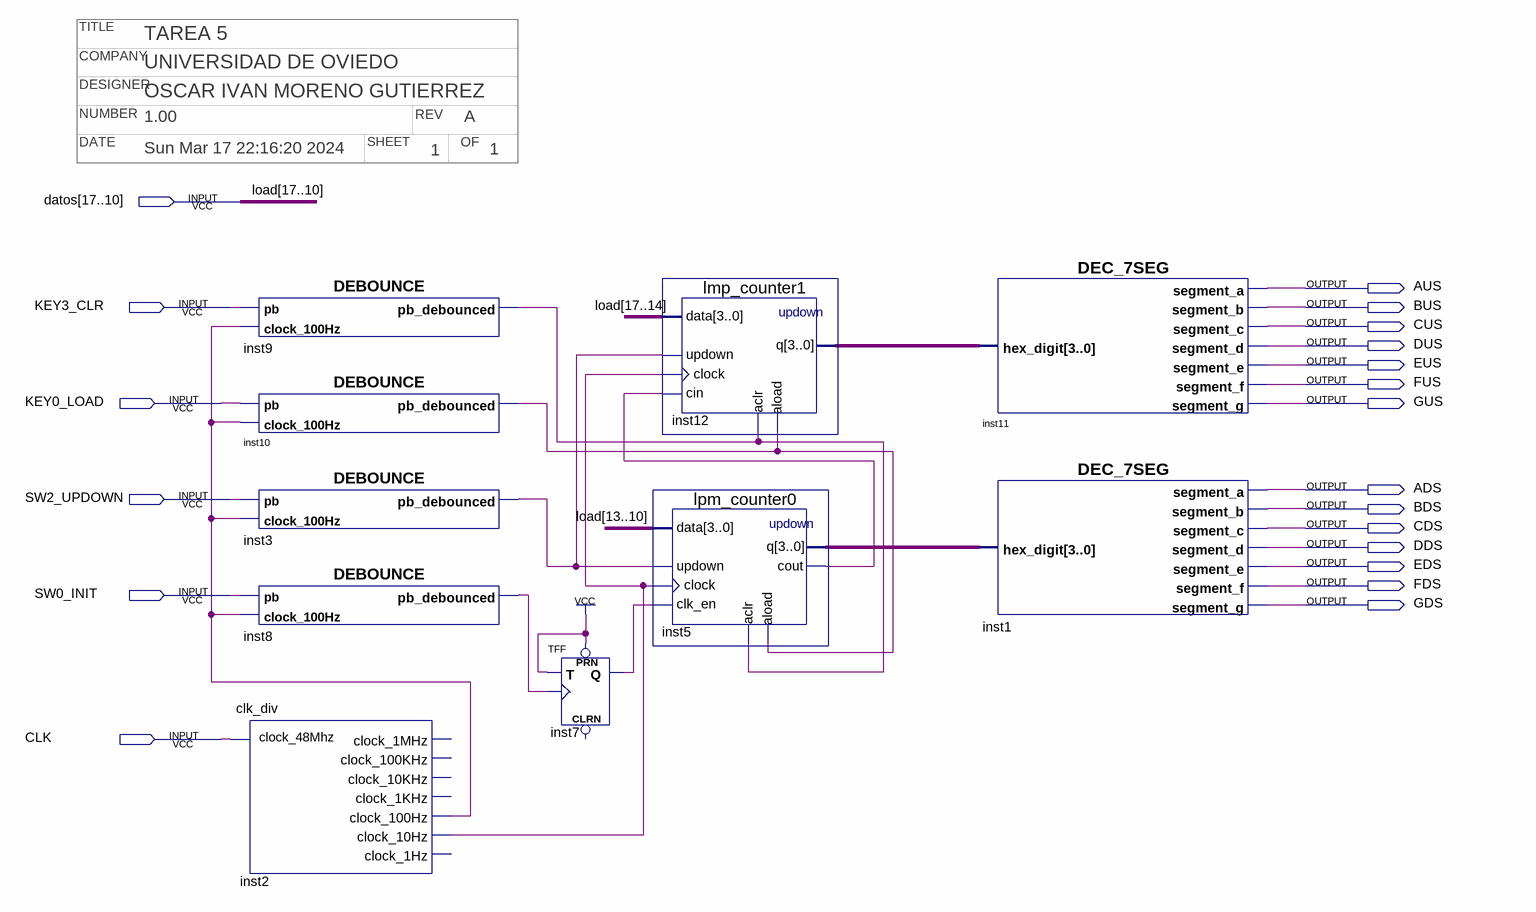
[diagram p0: schematic sheet]
// Quartus schematic tutor3.bdf as structural Verilog: 10 symbols, 20 pins
// Title block: COMPANY: UNIVERSIDAD DE OVIEDO; DATE: Sun Mar 17 22:16:20 2024; DESIGNER: OSCAR IVAN MORENO GUTIERREZ; NUMBER: 1.00; OF: 1; REV: A; SHEET: 1; TITLE: TAREA 5
module tutor3 (
  input  [17:10] datos,
  input  KEY3_CLR,
  input  KEY0_LOAD,
  input  SW2_UPDOWN,
  input  SW0_INIT,
  input  CLK,
  output AUS,
  output BUS,
  output CUS,
  output DUS,
  output EUS,
  output FUS,
  output GUS,
  output ADS,
  output BDS,
  output CDS,
  output DDS,
  output EDS,
  output FDS,
  output GDS
);

  wire inst2_clock_10hz, inst2_clock_100hz, inst3_pb_debounced, inst5_cout, inst7_q, inst8_pb_debounced,
       inst9_pb_debounced, inst10_pb_debounced;
  wire [3:0] inst5_q, inst12_q;

  DEBOUNCE inst9 (.pb(KEY3_CLR), .clock_100Hz(inst2_clock_100hz), .pb_debounced(inst9_pb_debounced));
  DEBOUNCE inst10 (.pb(KEY0_LOAD), .clock_100Hz(inst2_clock_100hz), .pb_debounced(inst10_pb_debounced));
  DEBOUNCE inst3 (.pb(SW2_UPDOWN), .clock_100Hz(inst2_clock_100hz), .pb_debounced(inst3_pb_debounced));
  DEBOUNCE inst8 (.pb(SW0_INIT), .clock_100Hz(inst2_clock_100hz), .pb_debounced(inst8_pb_debounced));
  clk_div inst2 (
    .clock_48Mhz(CLK), .clock_100Hz(inst2_clock_100hz), .clock_10Hz(inst2_clock_10hz));  // open: clock_1MHz, clock_100KHz, clock_10KHz, clock_1KHz, clock_1Hz
  TFF inst7 (.PRN(1'b1), .T(1'b1), .CLK(inst8_pb_debounced), .Q(inst7_q));  // open: CLRN
  lmp_counter1 inst12 (
    .data(datos[17:14]), .updown(inst3_pb_debounced), .clock(inst2_clock_10hz), .cin(inst5_cout),
    .aclr(inst9_pb_debounced), .aload(inst10_pb_debounced), .q(inst12_q));
  lpm_counter0 inst5 (
    .data(datos[13:10]), .updown(inst3_pb_debounced), .clock(inst2_clock_10hz), .clk_en(inst7_q),
    .aclr(inst9_pb_debounced), .aload(inst10_pb_debounced), .cout(inst5_cout), .q(inst5_q));
  DEC_7SEG inst11 (
    .hex_digit(inst12_q), .segment_a(AUS), .segment_b(BUS), .segment_c(CUS), .segment_d(DUS),
    .segment_e(EUS), .segment_f(FUS), .segment_g(GUS));
  DEC_7SEG inst1 (
    .hex_digit(inst5_q), .segment_a(ADS), .segment_b(BDS), .segment_c(CDS), .segment_d(DDS), .segment_e(EDS),
    .segment_f(FDS), .segment_g(GDS));

  // Other names for the same wires on the sheet: load[17:10] = datos
endmodule
